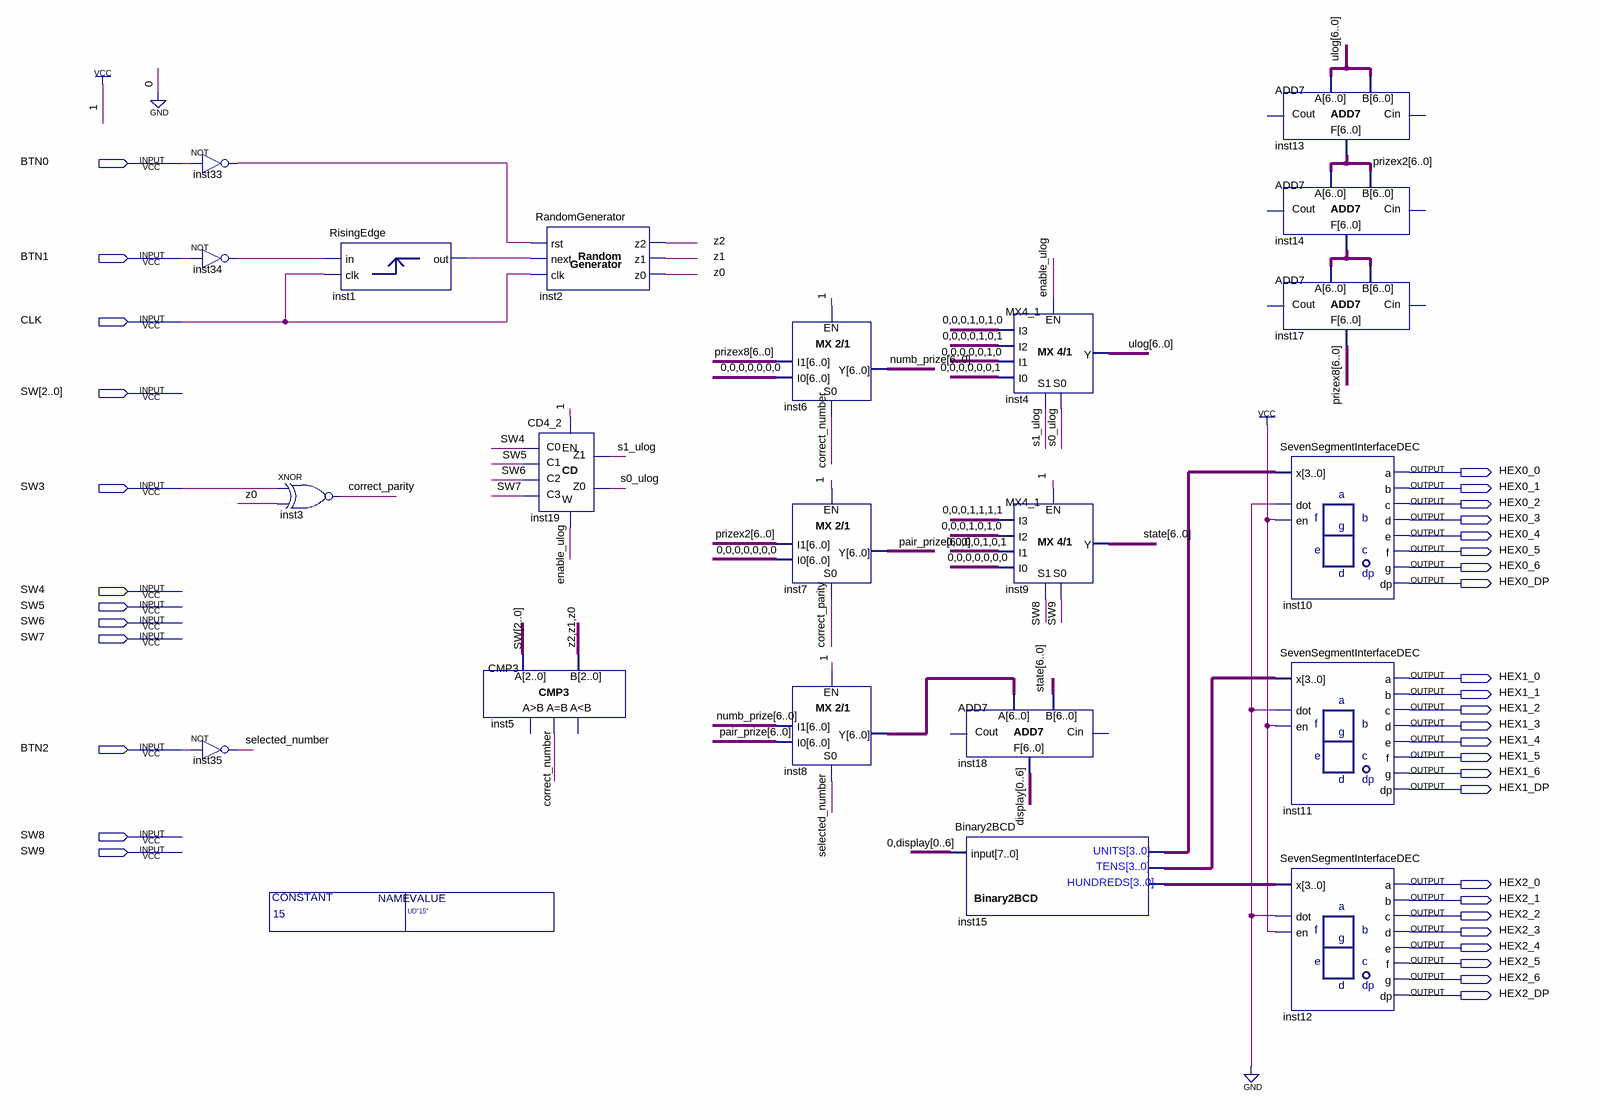
[diagram p0: schematic sheet]
// Quartus schematic PORT_LAB3.bdf as structural Verilog: 21 symbols, 36 pins
module PORT_LAB3 #(parameter \15  = "UD\"15\"") (
  input  BTN0,
  input  BTN1,
  input  CLK,
  input  [2:0] SW,
  input  SW3,
  input  SW4,
  input  SW5,
  input  SW6,
  input  SW7,
  input  BTN2,
  input  SW8,
  input  SW9,
  output HEX0_0,
  output HEX0_1,
  output HEX0_2,
  output HEX0_3,
  output HEX0_4,
  output HEX0_5,
  output HEX0_6,
  output HEX0_DP,
  output HEX1_0,
  output HEX1_1,
  output HEX1_2,
  output HEX1_3,
  output HEX1_4,
  output HEX1_5,
  output HEX1_6,
  output HEX1_DP,
  output HEX2_0,
  output HEX2_1,
  output HEX2_2,
  output HEX2_3,
  output HEX2_4,
  output HEX2_5,
  output HEX2_6,
  output HEX2_DP
);

  wire correct_number, correct_parity, enable_ulog, inst1_output, inst33_out, inst34_out, s0_ulog, s1_ulog,
       selected_number, z0, z1, z2;
  wire [3:0] inst15_bcd_hundreds, inst15_bcd_tens, inst15_bcd_units;
  wire [6:0] display, inst8_y, inst14_f, numb_prize, pair_prize, prizex2, prizex8, state, ulog;

  not inst33 (inst33_out, BTN0);
  not inst34 (inst34_out, BTN1);
  not inst35 (selected_number, BTN2);
  RisingEdge inst1 (.clk(CLK), .\input (inst34_out), .\output (inst1_output));
  xnor inst3 (correct_parity, SW3, z0);
  CMP3 inst5 (.A(SW), .B({z2, z1, z0}), .AeqB(correct_number));  // open: AgrB, AloB
  RandomGenerator inst2 (.NXT(inst1_output), .RST(inst33_out), .CLK(CLK), .Z2(z2), .Z1(z1), .Z0(z0));
  CD4_2 inst19 (.C0(SW4), .C1(SW5), .C2(SW6), .C3(SW7), .EN(1'b1), .Z0(s0_ulog), .Z1(s1_ulog), .W(enable_ulog));
  MX2_1 inst6 (.S0(correct_number), .EN(1'b1), .I0({7{1'b0}}), .I1(prizex8), .Y(numb_prize));
  MX2_1 inst7 (.S0(correct_parity), .EN(1'b1), .I0({7{1'b0}}), .I1(prizex2), .Y(pair_prize));
  MX2_1 inst8 (.S0(selected_number), .EN(1'b1), .I0(pair_prize), .I1(numb_prize), .Y(inst8_y));
  ADD7 inst18 (
    .A(inst8_y), .B(state),
    .F({display[0], display[1], display[2], display[3], display[4], display[5], display[6]}));  // open: Cin, Cout
  Binary2BCD inst15 (
    .\input ({1'b0, display[0], display[1], display[2], display[3], display[4], display[5], display[6]}),
    .bcd_hundreds(inst15_bcd_hundreds), .bcd_tens(inst15_bcd_tens), .bcd_units(inst15_bcd_units));
  MX4_1 inst4 (
    .S1(s1_ulog), .S0(s0_ulog), .EN(enable_ulog), .I3(7'b0001010), .I2(7'b0000101), .I1(7'b0000010),
    .I0(7'b0000001), .Y(ulog));
  MX4_1 inst9 (
    .S1(SW8), .S0(SW9), .EN(1'b1), .I3(7'b0001111), .I2(7'b0001010), .I1(7'b0000101), .I0({7{1'b0}}),
    .Y(state));
  ADD7 inst13 (.A(ulog), .B(ulog), .F(prizex2));  // open: Cin, Cout
  ADD7 inst14 (.A(prizex2), .B(prizex2), .F(inst14_f));  // open: Cin, Cout
  ADD7 inst17 (.A(inst14_f), .B(inst14_f), .F(prizex8));  // open: Cin, Cout
  SevenSegmentInterfaceDEC inst10 (
    .dot(1'b0), .en(1'b1), .x(inst15_bcd_units), .a(HEX0_0), .b(HEX0_1), .c(HEX0_2), .d(HEX0_3), .e(HEX0_4),
    .f(HEX0_5), .g(HEX0_6), .dp(HEX0_DP));
  SevenSegmentInterfaceDEC inst11 (
    .dot(1'b0), .en(1'b1), .x(inst15_bcd_tens), .a(HEX1_0), .b(HEX1_1), .c(HEX1_2), .d(HEX1_3), .e(HEX1_4),
    .f(HEX1_5), .g(HEX1_6), .dp(HEX1_DP));
  SevenSegmentInterfaceDEC inst12 (
    .dot(1'b0), .en(1'b1), .x(inst15_bcd_hundreds), .a(HEX2_0), .b(HEX2_1), .c(HEX2_2), .d(HEX2_3),
    .e(HEX2_4), .f(HEX2_5), .g(HEX2_6), .dp(HEX2_DP));
endmodule
